# Altium schematic sheet Programador.SchDoc
size A4; SheetNumber: 1; SheetTotal: 3
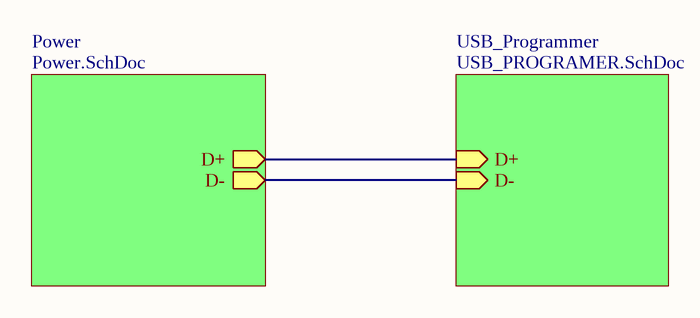
[diagram p0: Programador.SchDoc]

## Sub-sheets
Power = Power.SchDoc: D+ (out), D- (out)
USB_Programmer = USB_PROGRAMER.SchDoc: D- (in), D+ (in)

## Nets
(unnamed): sheet Power/D+, sheet USB_Programmer/D+
(unnamed): sheet Power/D-, sheet USB_Programmer/D-